# Altium schematic sheet Tone Cushion.SchDoc (part 1 of 3)
size 304 x 241 mm
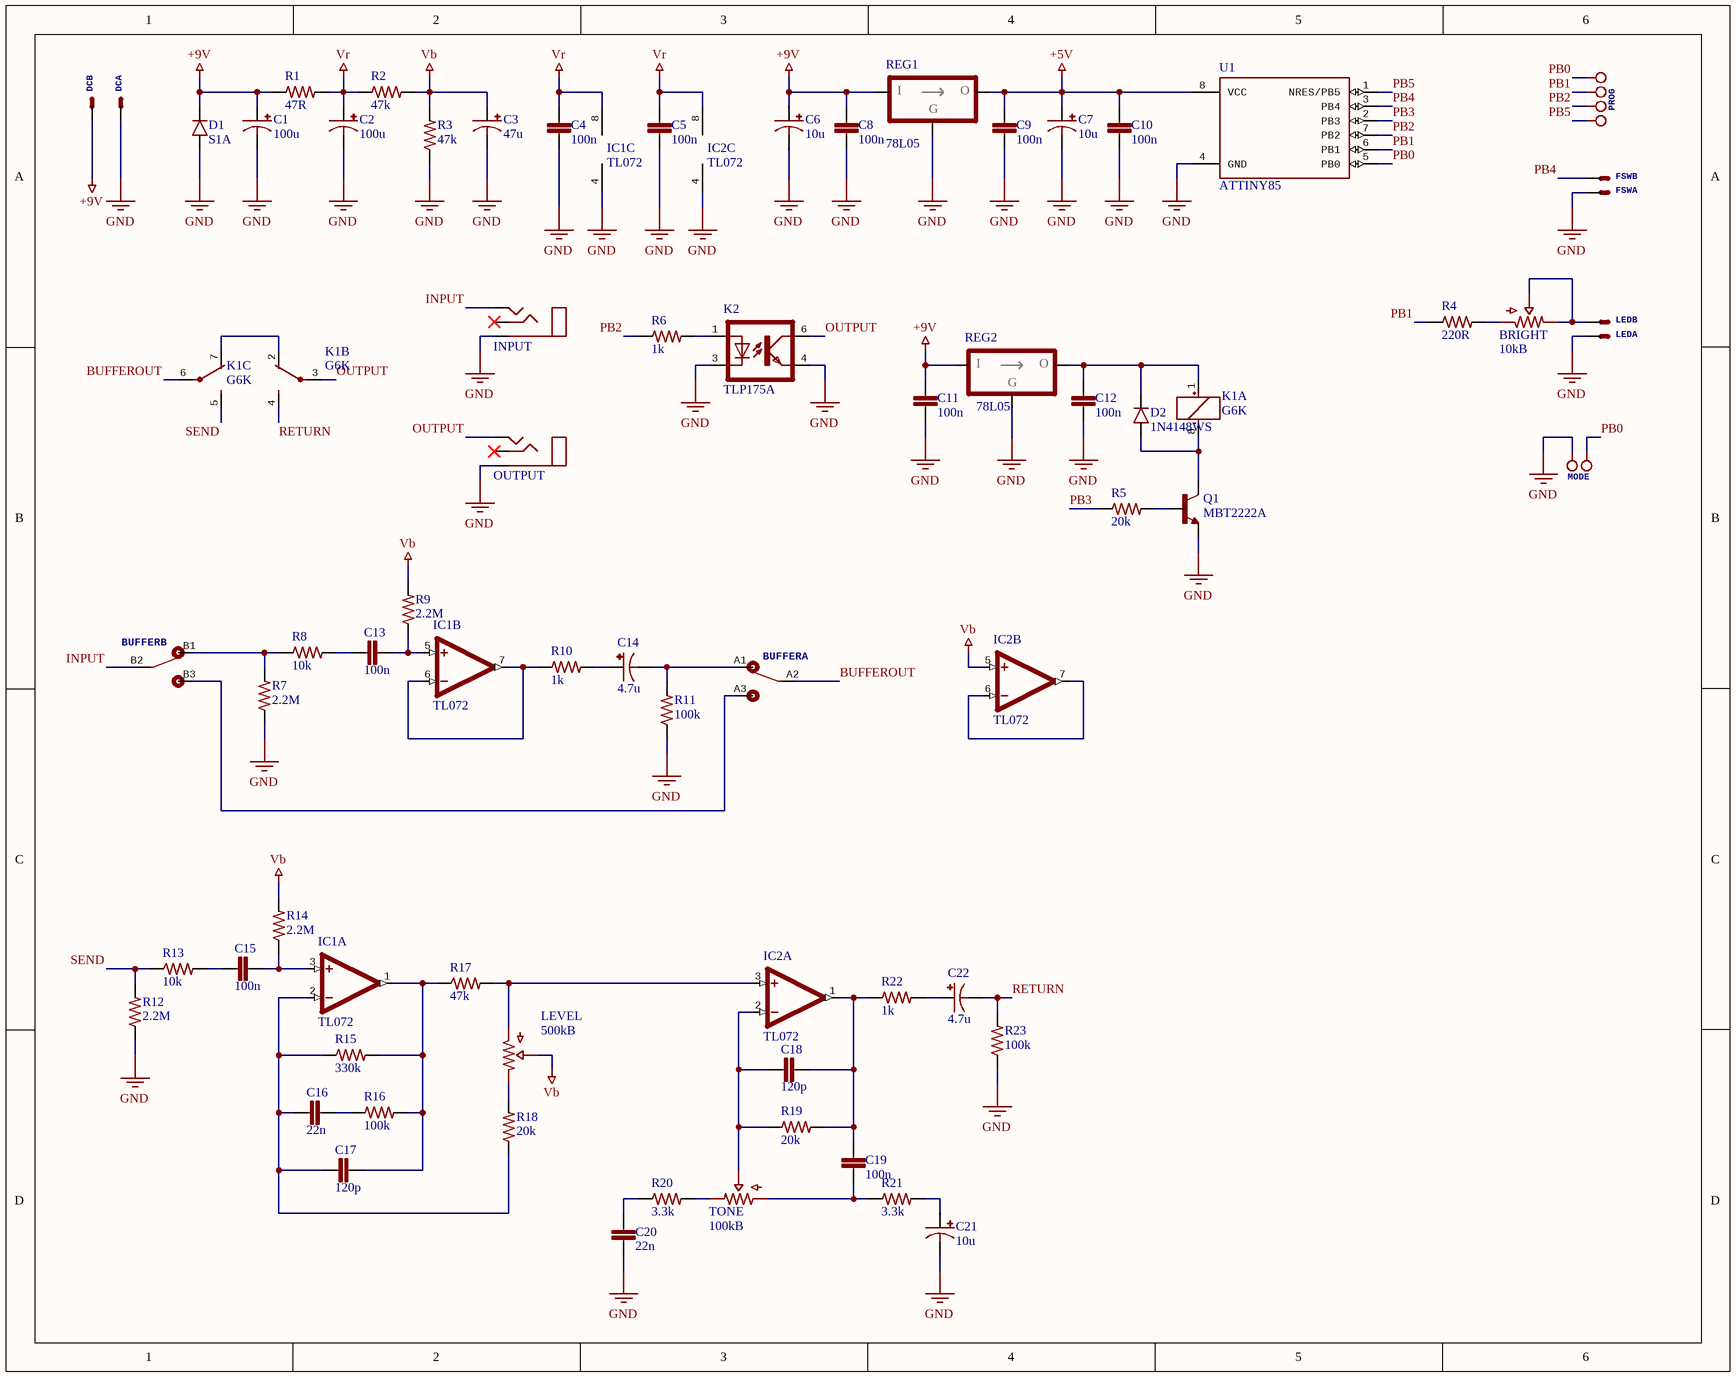
[diagram p0: Tone Cushion.SchDoc]

## Parts
BRIGHT  10kB  [BOURNS_3362P]
BUFFER  DPDT  [DPDT_SLIDE]  (value not drawn)  (parts A,B of 2)
C1  100u  [CAPAE_D]
C2  100u  [CAPAE_D]
C3  47u  [CAPAE_D]
C4  100n  [CHIP_0603]
C5  100n  [CHIP_0603]
C6  10u  [CAPAE_B]
C7  10u  [CAPAE_B]
C8  100n  [CHIP_0603]
C9  100n  [CHIP_0603]
C10  100n  [CHIP_0603]
C11  100n  [CHIP_0603]
C12  100n  [CHIP_0603]
C13  100n  [CHIP_1206]
C14  4.7u  [CAPAE_C]
C15  100n  [CHIP_1206]
C16  22n  [CHIP_0805]
C17  120p  [CHIP_0603]
C18  120p  [CHIP_0603]
C19  100n  [CHIP_1206]
C20  22n  [CHIP_0805]
C21  10u  [CAPAE_C]
C22  4.7u  [CAPAE_C]
D1  S1A  [DO214]
D2  1N4148WS  [SOD323]
DC  J_JST-XH-02  [JST-XH-02]  (value not drawn)  (parts A,B of 2)
FSW  J_JST-XH-02  [JST-XH-02]  (value not drawn)  (parts A,B of 2)
IC1  TL072  [SO-8]  (parts A,B,C of 3)
IC2  TL072  [SO-8]  (parts A,B,C of 3)
INPUT  J_STEREO  [STEREO]  (value not drawn)
K1  G6K  [G6K]  (parts A,B,C of 3)
K2  TLP175A  [TLP175A]
LED  J_JST-XH-02  [JST-XH-02]  (value not drawn)  (parts A,B of 2)
LEVEL  500kB  [ALPHA_16mm_BOTTOM]
MODE  J_HEADER_2PINS  [HEADER_2PINS]  (value not drawn)
OUTPUT  J_STEREO  [STEREO]  (value not drawn)
PROG  J_HEADER_4PINS_FEM  [HEADER_4Pins_FEM]  (value not drawn)
Q1  MBT2222A  [SOT323]
R1  47R  [CHIP_R_1206]
R2  47k  [CHIP_R_1206]
R3  47k  [CHIP_R_1206]
R4  220R  [CHIP_R_1206]
R5  20k  [CHIP_R_0603]
R6  1k  [CHIP_R_0603]
R7  2.2M  [CHIP_R_0603]
R8  10k  [CHIP_R_0603]
R9  2.2M  [CHIP_R_0603]
R10  1k  [CHIP_R_0603]
R11  100k  [CHIP_R_0603]
R12  2.2M  [CHIP_R_0603]
R13  10k  [CHIP_R_0603]
R14  2.2M  [CHIP_R_0603]
R15  330k  [CHIP_R_0603]
R16  100k  [CHIP_R_0603]
R17  47k  [CHIP_R_0603]
R18  20k  [CHIP_R_0603]
R19  20k  [CHIP_R_0603]
R20  3.3k  [CHIP_R_0603]
R21  3.3k  [CHIP_R_0603]
R22  1k  [CHIP_R_0603]
R23  100k  [CHIP_R_0603]
REG1  78L05  [SOT23-3]
REG2  78L05  [SOT23-3]
TONE  100kB  [ALPHA_16mm_BOTTOM]
U1  ATTINY85  [SOP8]

## Nets
+5V: C7.+ C9.1 C10.1 REG1.1(OUTPUT) U1.8(VCC)
+9V: C1.+ C6.+ C8.1 C11.1 D1.1 DC.1(S) R1.1 REG1.2(INPUT) REG2.2(INPUT)
GND: C1.- C2.- C3.- C4.2 C5.2 C6.- C7.- C8.2 C9.2 C10.2 C11.2 C12.2 C20.2 C21.- D1.2 DC.2(S) FSW.2(S) IC1.4(V-) IC2.4(V-) INPUT.S K2.3(C) K2.4(EMIT) LED.2(S) MODE.1 OUTPUT.S Q1.2(E) R3.1 R7.1 R11.1 R12.1 R23.1 REG1.3(COMMON) REG2.3(COMMON) U1.4(GND)
Vb: C3.+ IC2.5(+IN) LEVEL.2 R2.2 R3.2 R9.2 R14.2
Vr: C2.+ C4.1 C5.1 IC1.8(V+) IC2.8(V+) R1.2 R2.1
BUFFEROUT: BUFFER.A2 K1.6(P)
INPUT: BUFFER.B2 INPUT.T
OUTPUT: K1.3(P) K2.6(COL) OUTPUT.T
PB0: MODE.2 PROG.4 U1.5(PB0)
PB1: PROG.3 R4.1 U1.6(PB1)
PB2: PROG.2 R6.1 U1.7(PB2)
PB3: R5.1 U1.2(PB3)
PB4: FSW.1(S) U1.3(PB4)
PB5: PROG.1 U1.1(NRES/PB5)
RETURN: C22.- K1.4(S) R23.2
SEND: K1.5(S) R12.2 R13.1
NetBRIGHT_1: BRIGHT.1 R4.2
NetBRIGHT_2: BRIGHT.2 BRIGHT.3 LED.1(S)
NetBUFFER_A1: BUFFER.A1 C14.- R11.2
NetBUFFER_A3: BUFFER.A3 BUFFER.B3
NetBUFFER_B1: BUFFER.B1 R7.2 R8.1
NetC12_1: C12.1 D2.1 K1.1(+) REG2.1(OUTPUT)
NetC13_1: C13.1 IC1.5(+IN) R9.1
NetC13_2: C13.2 R8.2
NetC14_+: C14.+ R10.2
NetC15_1: C15.1 IC1.3(+IN) R14.1
NetC15_2: C15.2 R13.2
NetC16_1: C16.1 R16.1
NetC16_2: C16.2 C17.2 IC1.2(-IN) R15.1 R18.1
NetC17_1: C17.1 IC1.1(OUT) R15.2 R16.2 R17.1
NetC18_1: C18.1 C19.1 IC2.1(OUT) R19.2 R22.1
NetC18_2: C18.2 IC2.2(-IN) R19.1 TONE.2
NetC19_2: C19.2 R21.1 TONE.1
NetC20_1: C20.1 R20.1
NetC21_+: C21.+ R21.2
NetC22_+: C22.+ R22.2
NetD2_2: D2.2 K1.8(-) Q1.3(C)
NetIC1_6: IC1.6(-IN) IC1.7(OUT) R10.1
NetIC2_3: IC2.3(+IN) LEVEL.1 R17.2
NetIC2_6: IC2.6(-IN) IC2.7(OUT)
NetK1_2: K1.2(O) K1.7(O)
NetK2_1: K2.1(A) R6.2
NetLEVEL_3: LEVEL.3 R18.2
NetQ1_1: Q1.1(B) R5.2
NetR20_2: R20.2 TONE.3

Not connected (* = marked no-connect by the designer): INPUT R*; OUTPUT R*